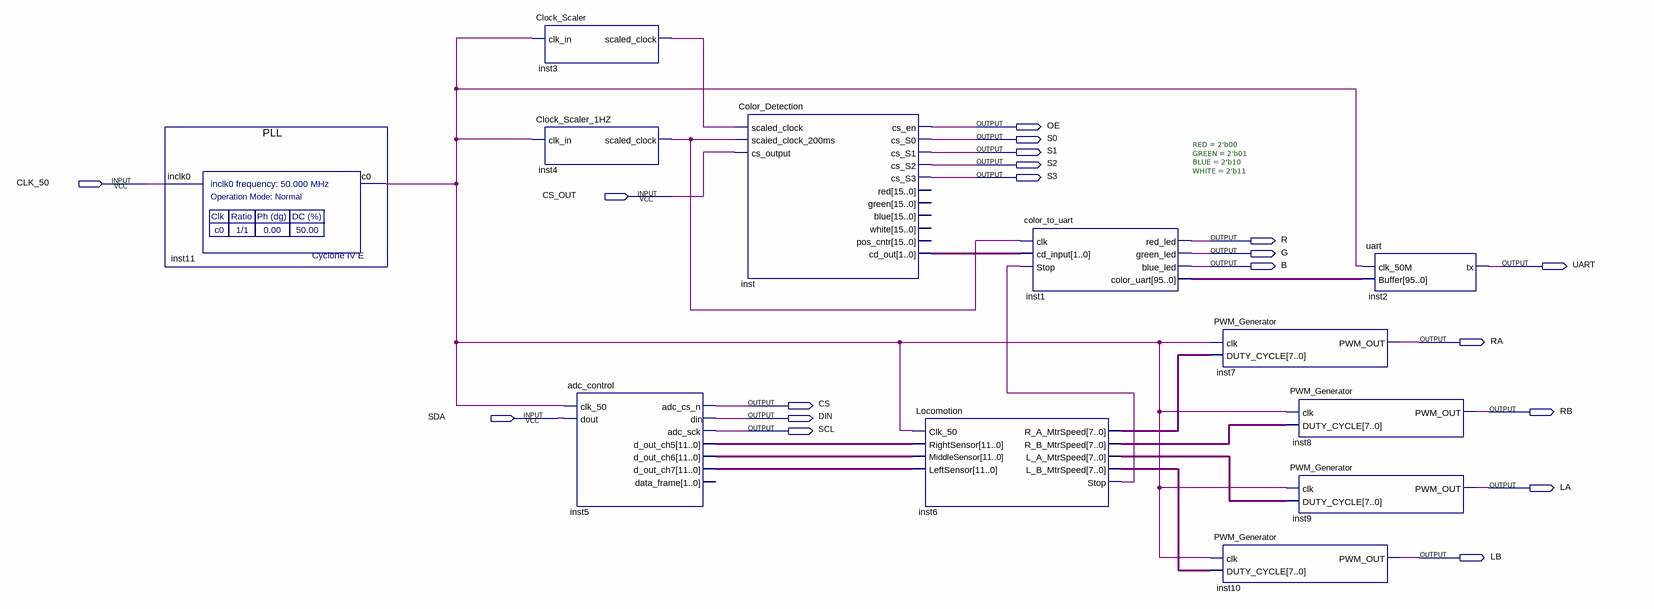
[diagram p0: schematic sheet]
// Quartus schematic SM1991_Task4.bdf as structural Verilog: 12 symbols, 19 pins
module SM1991_Task4 (
  input  CLK_50,
  input  CS_OUT,
  input  SDA,
  output OE,
  output S0,
  output S1,
  output S2,
  output S3,
  output R,
  output G,
  output B,
  output UART,
  output RA,
  output CS,
  output RB,
  output DIN,
  output SCL,
  output LA,
  output LB
);

  wire inst3_scaled_clock, inst4_scaled_clock, inst6_stop, inst11_c0;
  wire [1:0] inst_cd_out;
  wire [7:0] inst6_l_a_mtrspeed, inst6_l_b_mtrspeed, inst6_r_a_mtrspeed, inst6_r_b_mtrspeed;
  wire [11:0] inst5_d_out_ch5, inst5_d_out_ch6, inst5_d_out_ch7;
  wire [95:0] inst1_color_uart;

  PLL inst11 (.inclk0(CLK_50), .c0(inst11_c0));
  Clock_Scaler inst3 (.clk_in(inst11_c0), .scaled_clock(inst3_scaled_clock));
  Clock_Scaler_1HZ inst4 (.clk_in(inst11_c0), .scaled_clock(inst4_scaled_clock));
  adc_control inst5 (
    .clk_50(inst11_c0), .dout(SDA), .adc_cs_n(CS), .din(DIN), .adc_sck(SCL), .d_out_ch5(inst5_d_out_ch5),
    .d_out_ch6(inst5_d_out_ch6), .d_out_ch7(inst5_d_out_ch7));  // open: data_frame
  Color_Detection inst (
    .scaled_clock(inst3_scaled_clock), .scaled_clock_200ms(inst4_scaled_clock), .cs_output(CS_OUT),
    .cs_en(OE), .cs_S0(S0), .cs_S1(S1), .cs_S2(S2), .cs_S3(S3), .cd_out(inst_cd_out));  // open: red, green, blue, white, pos_cntr
  Locomotion inst6 (
    .Clk_50(inst11_c0), .RightSensor(inst5_d_out_ch5), .MiddleSensor(inst5_d_out_ch6),
    .LeftSensor(inst5_d_out_ch7), .R_A_MtrSpeed(inst6_r_a_mtrspeed), .R_B_MtrSpeed(inst6_r_b_mtrspeed),
    .L_A_MtrSpeed(inst6_l_a_mtrspeed), .L_B_MtrSpeed(inst6_l_b_mtrspeed), .Stop(inst6_stop));
  color_to_uart #(.RED(2'b00), .GREEN(2'b01), .BLUE(2'b10), .WHITE(2'b11)) inst1 (
    .clk(inst4_scaled_clock), .cd_input(inst_cd_out), .Stop(inst6_stop), .red_led(R), .green_led(G),
    .blue_led(B), .color_uart(inst1_color_uart));
  PWM_Generator inst7 (.clk(inst11_c0), .DUTY_CYCLE(inst6_r_a_mtrspeed), .PWM_OUT(RA));
  PWM_Generator inst10 (.clk(inst11_c0), .DUTY_CYCLE(inst6_l_b_mtrspeed), .PWM_OUT(LB));
  PWM_Generator inst8 (.clk(inst11_c0), .DUTY_CYCLE(inst6_r_b_mtrspeed), .PWM_OUT(RB));
  PWM_Generator inst9 (.clk(inst11_c0), .DUTY_CYCLE(inst6_l_a_mtrspeed), .PWM_OUT(LA));
  uart inst2 (.clk_50M(inst11_c0), .Buffer(inst1_color_uart), .tx(UART));
endmodule
